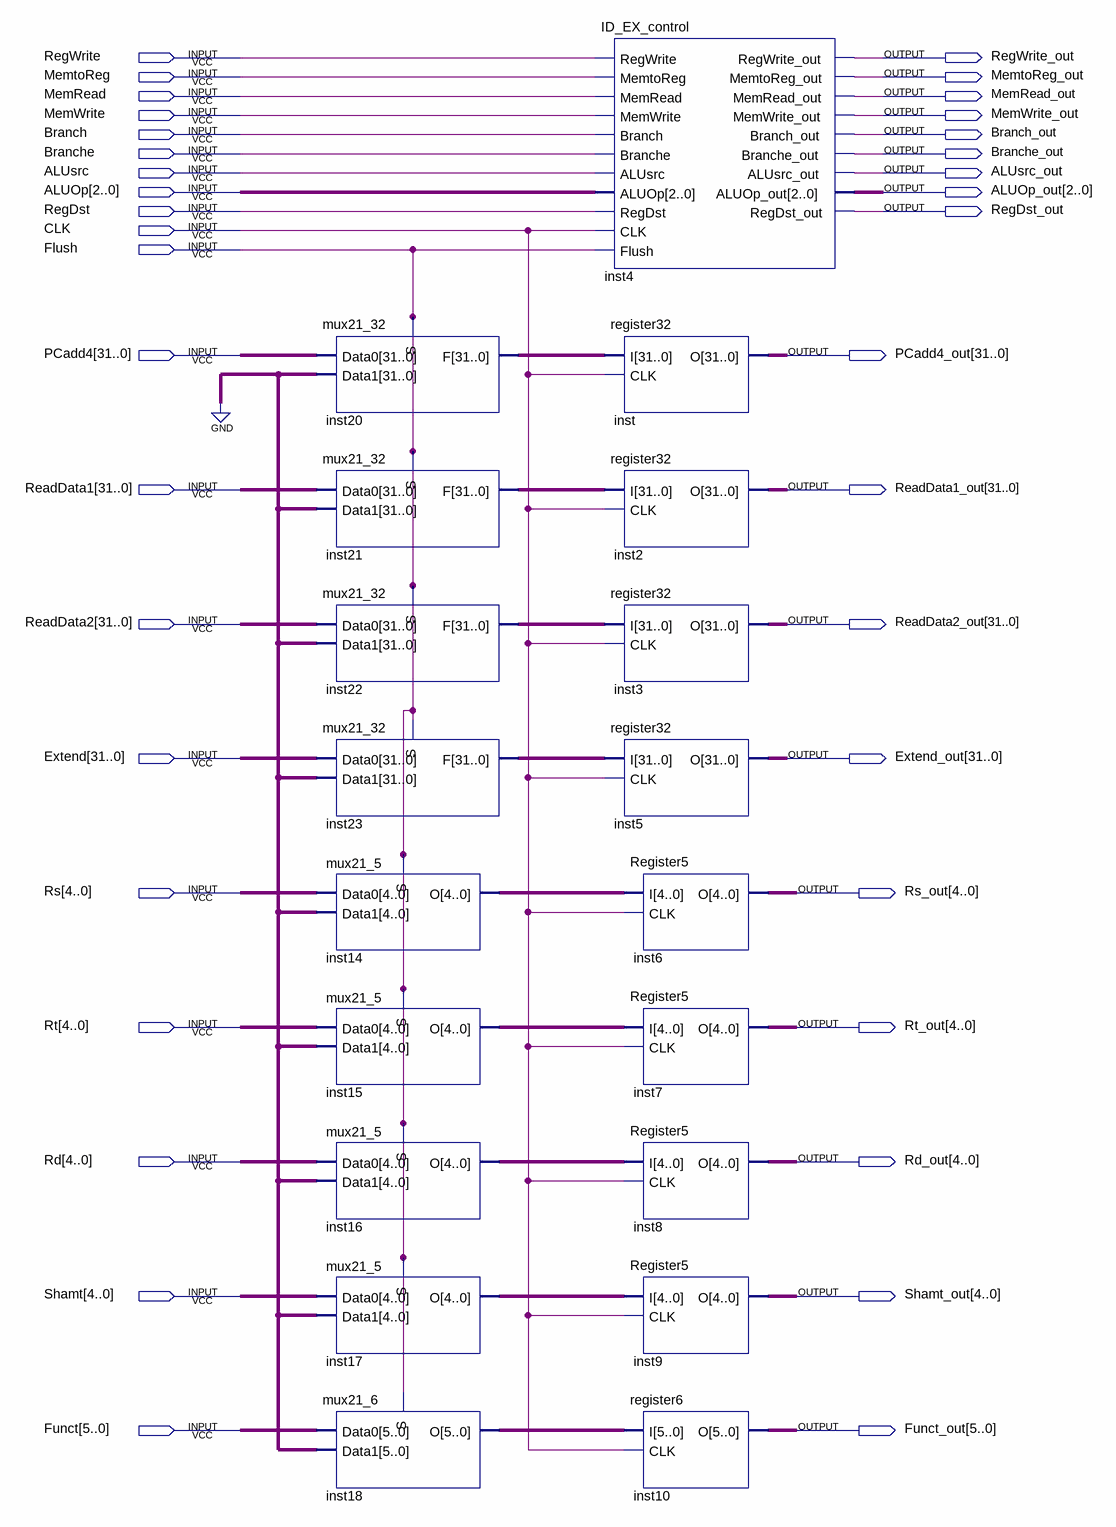
[diagram p0: schematic sheet]
// Quartus schematic ID_EX.bdf as structural Verilog: 19 symbols, 38 pins
module ID_EX (
  input  RegWrite,
  input  MemtoReg,
  input  MemRead,
  input  MemWrite,
  input  Branch,
  input  Branche,
  input  ALUsrc,
  input  [2:0] ALUOp,
  input  RegDst,
  input  CLK,
  input  Flush,
  input  [31:0] PCadd4,
  input  [31:0] ReadData1,
  input  [31:0] ReadData2,
  input  [31:0] Extend,
  input  [4:0] Rs,
  input  [4:0] Rt,
  input  [4:0] Rd,
  input  [4:0] Shamt,
  input  [5:0] Funct,
  output RegWrite_out,
  output MemtoReg_out,
  output MemRead_out,
  output MemWrite_out,
  output Branch_out,
  output Branche_out,
  output ALUsrc_out,
  output [2:0] ALUOp_out,
  output RegDst_out,
  output [31:0] PCadd4_out,
  output [31:0] ReadData1_out,
  output [31:0] ReadData2_out,
  output [31:0] Extend_out,
  output [4:0] Rs_out,
  output [4:0] Rt_out,
  output [4:0] Rd_out,
  output [4:0] Shamt_out,
  output [5:0] Funct_out
);

  wire [4:0] inst14_o, inst15_o, inst16_o, inst17_o;
  wire [5:0] inst18_o;
  wire [31:0] inst20_f, inst21_f, inst22_f, inst23_f;

  mux21_32 inst20 (.Data0(PCadd4), .Data1({32{1'b0}}), .S(Flush), .F(inst20_f));
  mux21_32 inst21 (.Data0(ReadData1), .Data1({32{1'b0}}), .S(Flush), .F(inst21_f));
  mux21_32 inst22 (.Data0(ReadData2), .Data1({32{1'b0}}), .S(Flush), .F(inst22_f));
  mux21_32 inst23 (.Data0(Extend), .Data1({32{1'b0}}), .S(Flush), .F(inst23_f));
  mux21_5 inst14 (.Data0(Rs), .Data1({32{1'b0}}), .S(Flush), .O(inst14_o));
  mux21_5 inst15 (.Data0(Rt), .Data1({32{1'b0}}), .S(Flush), .O(inst15_o));
  mux21_5 inst16 (.Data0(Rd), .Data1({32{1'b0}}), .S(Flush), .O(inst16_o));
  mux21_5 inst17 (.Data0(Shamt), .Data1({32{1'b0}}), .S(Flush), .O(inst17_o));
  mux21_6 inst18 (.Data0(Funct), .Data1({32{1'b0}}), .S(Flush), .O(inst18_o));
  ID_EX_control inst4 (
    .RegDst(RegDst), .RegWrite(RegWrite), .ALUsrc(ALUsrc), .Branch(Branch), .Branche(Branche),
    .MemRead(MemRead), .MemWrite(MemWrite), .MemtoReg(MemtoReg), .ALUOp(ALUOp), .CLK(CLK), .Flush(Flush),
    .RegDst_out(RegDst_out), .RegWrite_out(RegWrite_out), .ALUsrc_out(ALUsrc_out), .Branch_out(Branch_out),
    .Branche_out(Branche_out), .MemRead_out(MemRead_out), .MemWrite_out(MemWrite_out),
    .MemtoReg_out(MemtoReg_out), .ALUOp_out(ALUOp_out));
  register32 inst (.I(inst20_f), .CLK(CLK), .O(PCadd4_out));
  register32 inst2 (.I(inst21_f), .CLK(CLK), .O(ReadData1_out));
  register32 inst3 (.I(inst22_f), .CLK(CLK), .O(ReadData2_out));
  register32 inst5 (.I(inst23_f), .CLK(CLK), .O(Extend_out));
  Register5 inst6 (.I(inst14_o), .CLK(CLK), .O(Rs_out));
  Register5 inst7 (.I(inst15_o), .CLK(CLK), .O(Rt_out));
  Register5 inst8 (.I(inst16_o), .CLK(CLK), .O(Rd_out));
  Register5 inst9 (.I(inst17_o), .CLK(CLK), .O(Shamt_out));
  register6 inst10 (.I(inst18_o), .CLK(CLK), .O(Funct_out));
endmodule
